# EAGLE design smartstand-led-brightness-evaluation-rev-a (EAGLE 7.3.0)
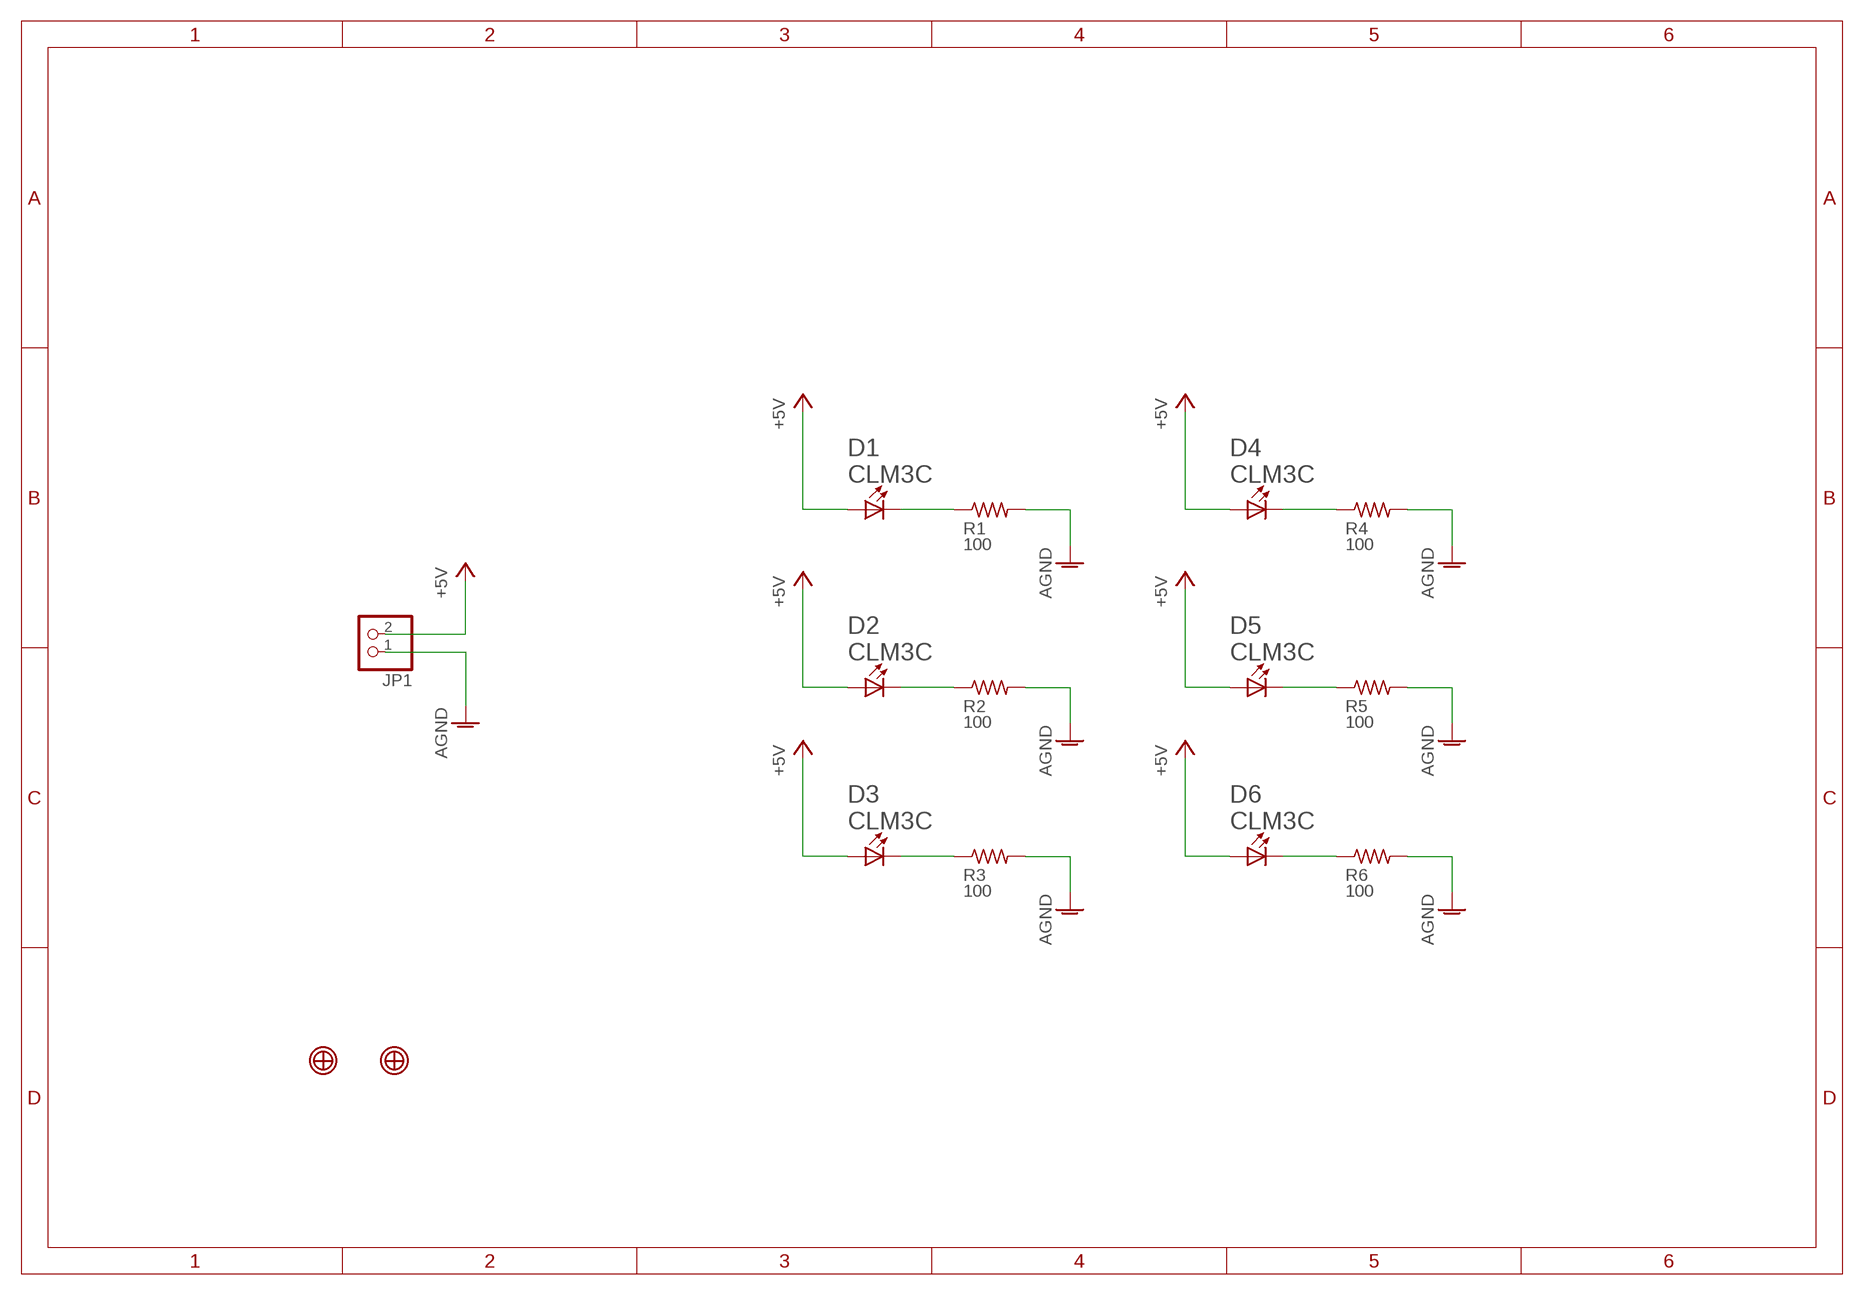
[diagram p0: schematic, sheet 1]
SHEET1 (A4L-NODOC): BOM: EXCLUDE

## Parts
D1  CLM3C  [PLCC-2]
D2  CLM3C  [PLCC-2]
D3  CLM3C  [PLCC-2]
D4  CLM3C  [PLCC-2]
D5  CLM3C  [PLCC-2]
D6  CLM3C  [PLCC-2]
JP1  PINHD-1X2  [1X02]
R1  100  RESISTOR-HORIZONTAL-0805  [R0805]
R2  100  RESISTOR-HORIZONTAL-0805  [R0805]
R3  100  RESISTOR-HORIZONTAL-0805  [R0805]
R4  100  RESISTOR-HORIZONTAL-0805  [R0805]
R5  100  RESISTOR-HORIZONTAL-0805  [R0805]
R6  100  RESISTOR-HORIZONTAL-0805  [R0805]
U$1  FIDUCIAL-1MM  [FIDUCIAL_1MM]
U$2  FIDUCIAL-1MM  [FIDUCIAL_1MM]

## Nets
+5V: D1.ANODE(A) D2.ANODE(A) D3.ANODE(A) D4.ANODE(A) D5.ANODE(A) D6.ANODE(A) JP1.2
AGND: JP1.1 R1.2 R2.2 R3.2 R4.2 R5.2 R6.2
N$1: D1.CATHODE(C) R1.1
N$2: D2.CATHODE(C) R2.1
N$3: D3.CATHODE(C) R3.1
N$4: D4.CATHODE(C) R4.1
N$5: D5.CATHODE(C) R5.1
N$6: D6.CATHODE(C) R6.1

## Library data of the parts
D1-D6 = cree:CLM3C: Cree® PLCC2 1-in-1 SMD LED CLM3C; PN: CLM3C-WKW-CXAYA453
JP1 = pin-headers:PINHD-1X2: PIN HEADER; BOM: EXCLUDE
R1-R6 = passives:RESISTOR-HORIZONTAL; PN: ERJ-6GEYJ101V
U$1 U$2 = fiducials:FIDUCIAL: Fidicual Mark Used by pick-and-place machines to align and orient boards before loading components.; BOM: EXCLUDE

## Board
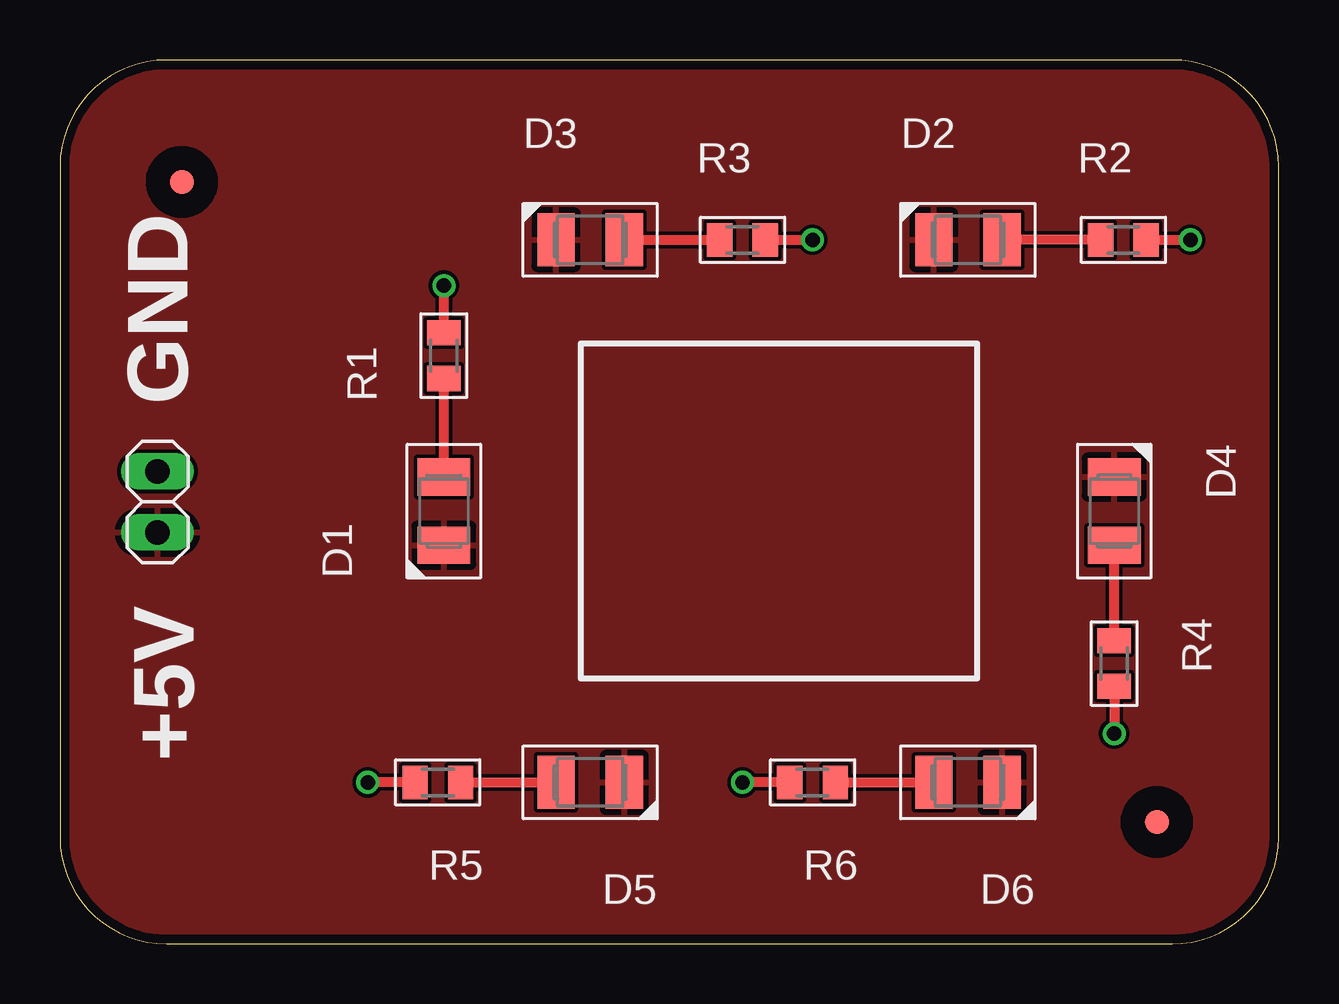
[diagram p1: board, top side]
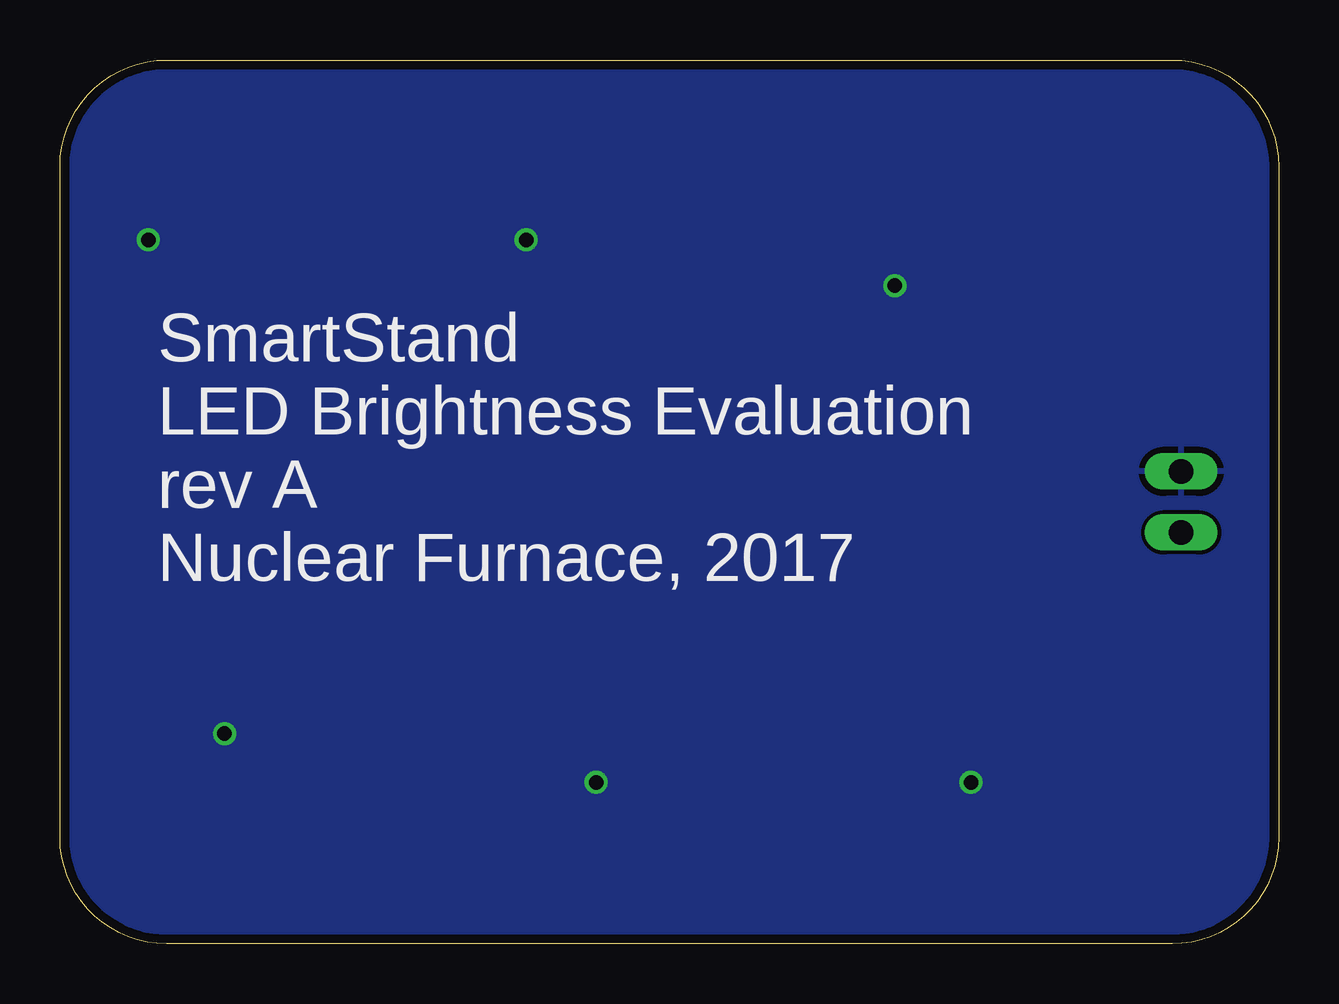
[diagram p2: board, bottom side, seen from below]

Size 50.8 x 36.83 mm. Coordinates in mm from the lower left corner, seen from the top.
Outline: 0,32.38 0,4.45 arc90 4.45,0 46.35,0 arc90 50.8,4.45 50.8,32.38 arc90 46.35,36.83 4.45,36.83 arc90 0,32.38
Copper layers (1*16): Top 0.035559375mm / dielectric 60mil / Bottom 0.035559375mm
Design rules "OSHPark-2Layer": minimum track width 6mil, minimum drill 13mil, track to track 6mil, track to pad 6mil, pad to pad 6mil, via to via 6mil, smd to smd 6mil, copper to edge 15mil, drill to drill 6mil, minimum pad ring 7mil, minimum via ring 7mil, stop-mask expansion 3mil, vias tented up to drill 14mil, thermal gap 10mil

### Footprints (pad centres in the part's own frame; a part is rotated, then mirrored left to right if it is on the bottom)
PLCC-2 = smd 1.55 x 2.2: ANODE -1.425,0; CATHODE 1.425,0
1X02 = drill 1.016 long: 1 -1.27,0; 2 1.27,0
R0805 = smd 1.05 x 1.4: 1 -0.95,0; 2 0.95,0
FIDUCIAL_1MM = smd 1 x 1: 1 0,0

### Placement (x,y rotation side)
D1  16,18.03 90 top
D2  37.85,29.34 0 top
D3  22.1,29.34 0 top
D4  43.94,18.03 270 top
D5  22.1,6.73 180 top
D6  37.85,6.73 180 top
JP1  4.06,18.41 270 top
R1  16,24.51 90 top
R2  44.32,29.34 0 top
R3  28.45,29.34 0 top
R4  43.94,11.68 270 top
R5  15.75,6.73 180 top
R6  31.37,6.73 180 top
U$1  45.72,5.08 0 top
U$2  5.08,31.75 0 top

### Tracks (layer width: path | path; a pad name or v marks a point on that pad's centre or on a via)
+5V
  pour Top: 4.45,36.83 46.35,36.83 arc-90 50.8,32.38 50.8,4.45 arc-90 46.35,0 4.45,0 arc-90 0,4.45 0,32.38 arc-90
AGND  (via drill 0.6)
  Top 0.406: R5.2 v12.83,6.73 | R6.2 v28.45,6.73 | R1.2 v16,27.43 | R3.2 v31.37,29.34 | R2.2 v47.12,29.34 | R4.2 v43.94,8.76
  pour Bottom: 4.45,36.83 46.35,36.83 arc-90 50.8,32.38 50.8,4.45 arc-90 46.35,0 4.45,0 arc-90 0,4.45 0,32.38 arc-90
N$1
  Top 0.406: D1.CATHODE R1.1
N$2
  Top 0.406: R2.1 D2.CATHODE
N$3
  Top 0.406: D3.CATHODE R3.1
N$4
  Top 0.406: R4.1 D4.CATHODE
N$5
  Top 0.406: R5.1 D5.CATHODE
N$6
  Top 0.406: R6.1 D6.CATHODE

### Text on the board
tNames: GND | +5V
bNames: SmartStand / LED Brightness Evaluation / rev A / Nuclear Furnace, 2017